# EAGLE design wind direction sensor (EAGLE 7.6.0)
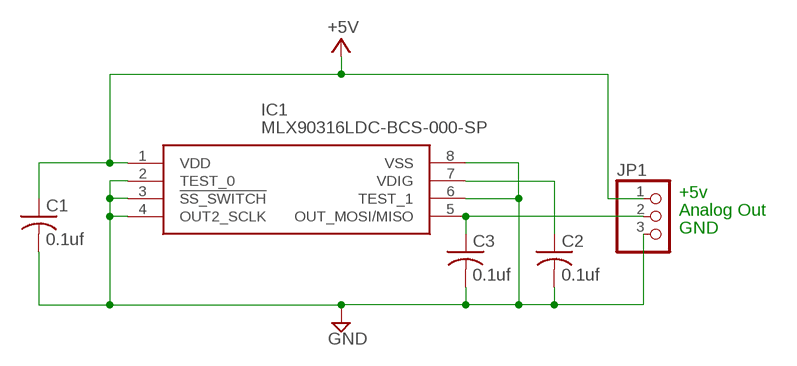
[diagram p0: schematic, sheet 1]

## Parts
C1  0.1uf  C-USC1206K  [C1206K]
C2  0.1uf  C-USC1206K  [C1206K]
C3  0.1uf  C-USC1206K  [C1206K]
IC1  MLX90316LDC-BCS-000-SP  [SOIC127P600X172-8N]
JP1  PINHD-1X3  [1X03]

## Nets
+5V: C1.1 IC1.1(VDD) JP1.1
GND: C1.2 C2.2 C3.2 IC1.2(TEST_0) IC1.3(!SS_SWITCH) IC1.4(OUT2_SCLK) IC1.6(TEST_1) IC1.8(VSS) JP1.3
N$2: C3.1 IC1.5(OUT_MOSI/MISO) JP1.2
N$4: C2.1 IC1.7(VDIG)

## Notes on the sheet
- +5v
- Analog Out
- GND

## Library data of the parts
C1-C3 = adafruit:C-US: CAPACITOR, American symbol
IC1 = SamacSys_Parts:MLX90316LDC-BCS-000-SP: Board Mount Motion & Position Sensors Triaxis Programmable Rotary Position Sensor feat. Dual Matched Ratiometric Analog & PWM Outputs (Gen. I ) Source: Datasheet <https://mel-prd-cdn.azureedge.net/-/media/files/documents/datasheets/mlx90316-datasheet-melexis.pdf>; DESCRIPTION: Board Mount Motion & Position Sensors Triaxis Programmable Rotary Position Sensor feat. Dual Matched Ratiometric Analog & PWM Outputs (Gen. I ); HEIGHT: 1.72mm; MANUFACTURER_NAME: Melexis; MANUFACTURER_PART_NUMBER: MLX90316LDC-BCS-000-SP; MOUSER_PART_NUMBER: 482-90316LDCBCS000SP; MOUSER_PRICE-STOCK: https://www.mouser.co.uk/ProductDetail/Melexis/MLX90316LDC-BCS-000-SP?qs=KuGPmAKtFKULB92ItQn%252BIA%3D%3D
JP1 = pinhead:PINHD-1X3: PIN HEADER

## Board
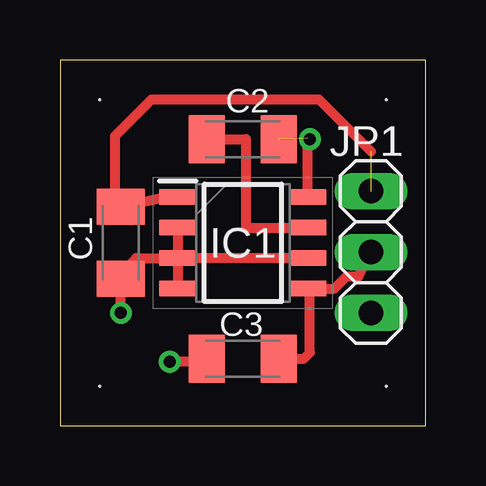
[diagram p1: board, top side]
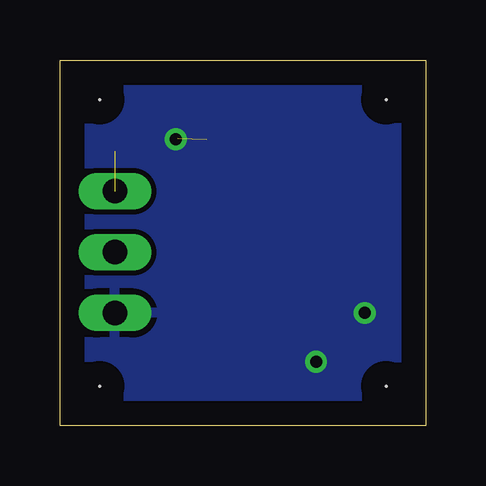
[diagram p2: board, bottom side, seen from below]

Size 15.24 x 15.24 mm. Coordinates in mm from the lower left corner, seen from the top.
Outline: 0,0 15.24,0 15.24,15.24 0,15.24 0,0
Copper layers (1*16): Top 0.035mm / dielectric 1.5mm / Bottom 0.035mm
Design rules "default": minimum track width 10mil, minimum drill 24mil, track to track 8mil, track to pad 8mil, pad to pad 8mil, via to via 8mil, smd to smd 8mil, copper to edge 40mil, drill to drill 8mil, minimum pad ring 10mil, minimum via ring 8mil, stop-mask expansion 4mil, vias tented up to drill 0mil, thermal gap 10mil
Holes 0.03 mm at 1.65,13.59 13.59,13.59 1.65,1.65 13.59,1.65

### Footprints (pad centres in the part's own frame; a part is rotated, then mirrored left to right if it is on the bottom)
C1206K = smd 1.5 x 2: 1 -1.5,0; 2 1.5,0
SOIC127P600X172-8N = smd 1.525 x 0.65: 1 -2.712,1.905; 2 -2.712,0.635; 3 -2.712,-0.635; 4 -2.712,-1.905; 5 2.712,-1.905; 6 2.712,-0.635; 7 2.712,0.635; 8 2.712,1.905
1X03 = drill 1.016 long: 1 -2.54,0; 2 0,0; 3 2.54,0

### Placement (x,y rotation side)
C1  2.54,7.62 270 top
C2  7.62,11.94 0 top
C3  7.62,2.79 180 top
IC1  7.62,7.62 0 top
JP1  12.95,7.24 270 top

### Tracks (layer width: path | path; a pad name or v marks a point on that pad's centre or on a via)
+5V  (1 unrouted)
  Top 0.406: IC1.1 4.8,9.63 C1.1 2.29,9.37 2.29,12.06 3.81,13.59 10.79,13.59 12.95,11.43
GND  (via drill 0.5)  (1 unrouted)
  Top 0.406: v2.54,4.7 C1.2 2.82,6.63 3.17,6.99 IC1.3 | C3.2 5.87,2.67 v4.57,2.67 | IC1.2 IC1.3 | IC1.3 IC1.4 | IC1.8 10.33,11.98 v10.41,11.94 | IC1.6 IC1.3
  pour Bottom: -0.38,15.49 -0.38,-0.25 15.75,-0.25 15.62,15.49
N$2
  Top 0.406: JP1.2 12.45,6.22 11.94,6.22 11.43,5.71 IC1.5 10.41,5.63 10.41,3.05 10.16,2.79 C3.1
N$4
  Top 0.406: C2.1 7.75,11.94 7.75,8.26 IC1.7